# Altium schematic sheet main--sheet.SchDoc
size A4; SheetNumber: 1; SheetTotal: 5
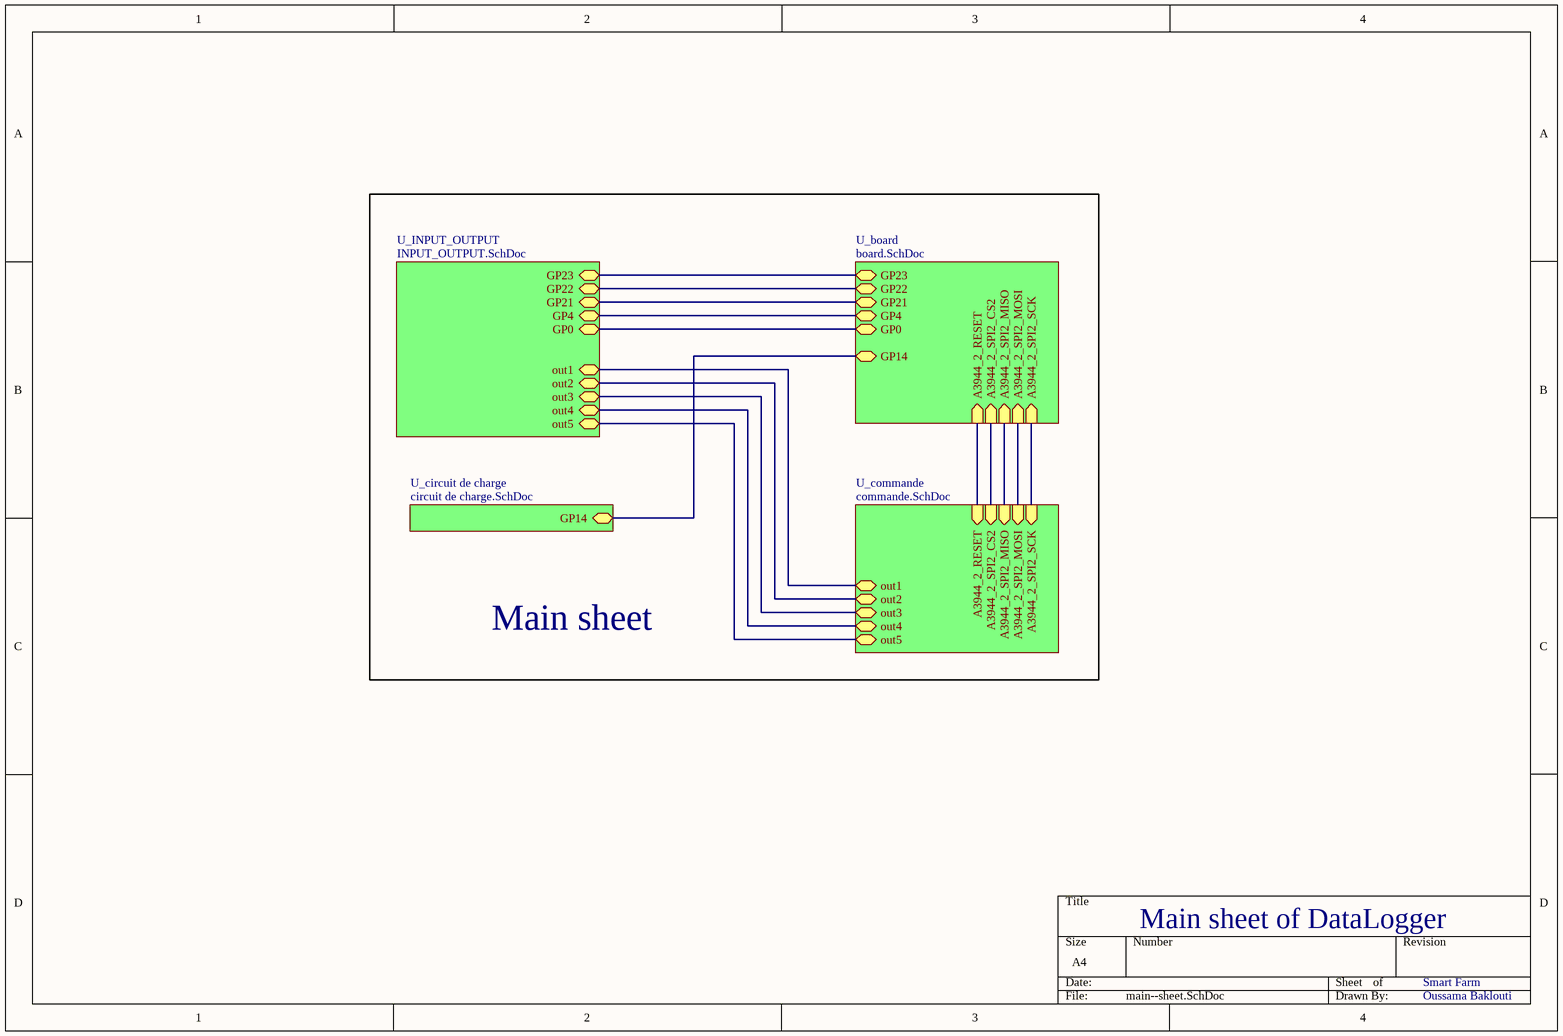
[diagram p0: main--sheet.SchDoc]

## Sub-sheets
U_board = board.SchDoc: GP23 (bidir), GP22 (bidir), GP21 (bidir), A3944_2_SPI2_SCK (in), A3944_2_SPI2_MOSI (in), A3944_2_SPI2_MISO (in), A3944_2_SPI2_CS2 (in), GP4 (bidir), GP0 (bidir), GP14 (bidir), A3944_2_RESET (in)
U_circuit de charge = circuit de charge.SchDoc: GP14 (bidir)
U_commande = commande.SchDoc: A3944_2_RESET (in), A3944_2_SPI2_MISO (in), A3944_2_SPI2_SCK (in), A3944_2_SPI2_MOSI (in), A3944_2_SPI2_CS2 (in), out1 (bidir), out2 (bidir), out3 (bidir), out4 (bidir), out5 (bidir)
U_INPUT_OUTPUT = INPUT_OUTPUT.SchDoc: GP23 (bidir), GP22 (bidir), GP21 (bidir), GP4 (bidir), GP0 (bidir), out1 (bidir), out2 (bidir), out3 (bidir), out4 (bidir), out5 (bidir)

## Nets
(unnamed): sheet U_board/GP23, sheet U_INPUT_OUTPUT/GP23
(unnamed): sheet U_board/GP22, sheet U_INPUT_OUTPUT/GP22
(unnamed): sheet U_board/GP21, sheet U_INPUT_OUTPUT/GP21
(unnamed): sheet U_board/A3944_2_SPI2_SCK, sheet U_commande/A3944_2_SPI2_SCK
(unnamed): sheet U_board/A3944_2_SPI2_MOSI, sheet U_commande/A3944_2_SPI2_MOSI
(unnamed): sheet U_board/A3944_2_SPI2_MISO, sheet U_commande/A3944_2_SPI2_MISO
(unnamed): sheet U_board/A3944_2_SPI2_CS2, sheet U_commande/A3944_2_SPI2_CS2
(unnamed): sheet U_board/GP4, sheet U_INPUT_OUTPUT/GP4
(unnamed): sheet U_board/GP0, sheet U_INPUT_OUTPUT/GP0
(unnamed): sheet U_board/GP14, sheet U_circuit de charge/GP14
(unnamed): sheet U_board/A3944_2_RESET, sheet U_commande/A3944_2_RESET
(unnamed): sheet U_commande/out1, sheet U_INPUT_OUTPUT/out1
(unnamed): sheet U_commande/out2, sheet U_INPUT_OUTPUT/out2
(unnamed): sheet U_commande/out3, sheet U_INPUT_OUTPUT/out3
(unnamed): sheet U_commande/out4, sheet U_INPUT_OUTPUT/out4
(unnamed): sheet U_commande/out5, sheet U_INPUT_OUTPUT/out5

## Notes on the sheet
- Main sheet
- Main sheet of DataLogger
- Smart Farm
- Oussama Baklouti